# Altium schematic sheet PCIe.SchDoc
size 297 x 209 mm
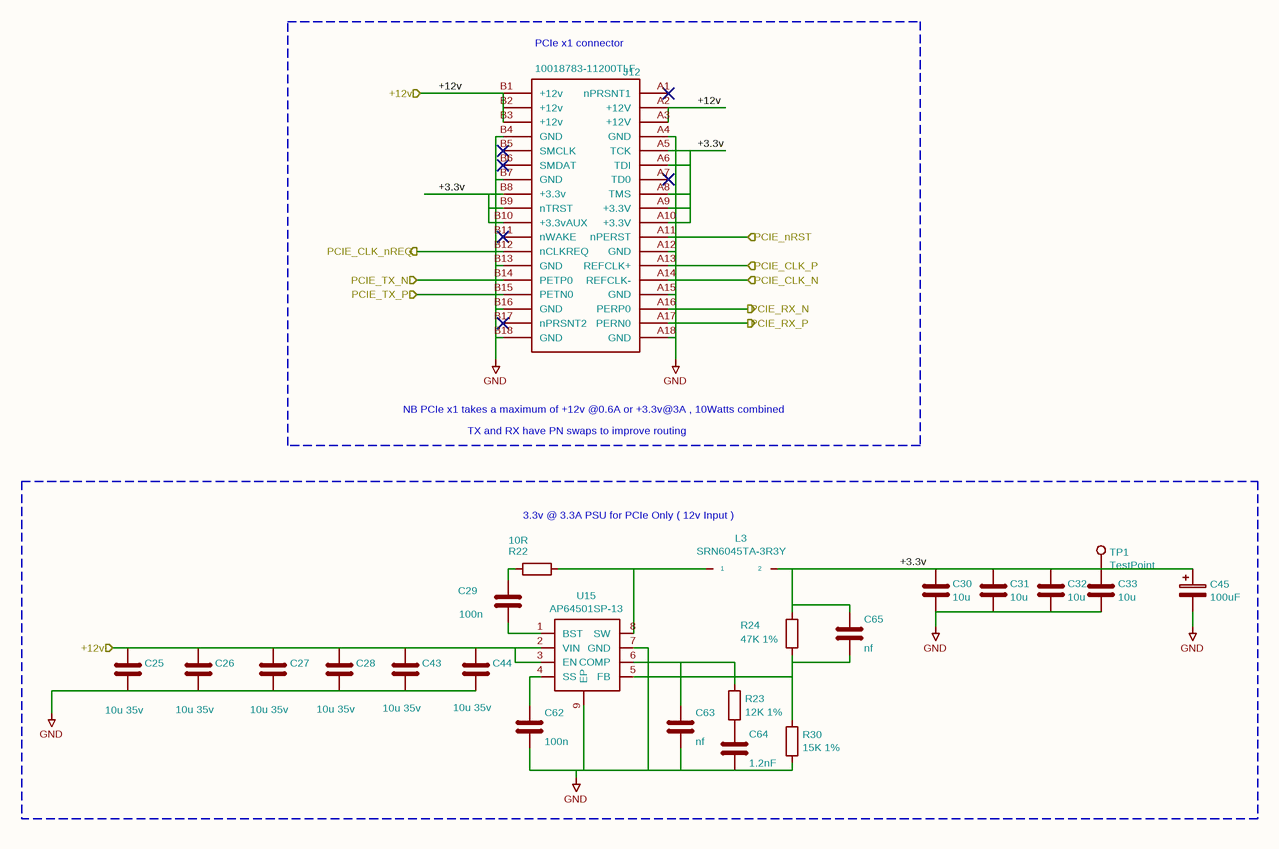
[diagram p0: PCIe.SchDoc]

## Parts
C25  10u 35v  [C_0805_2012Metric]
C26  10u 35v  [C_0805_2012Metric]
C27  10u 35v  [C_0805_2012Metric]
C28  10u 35v  [C_0805_2012Metric]
C29  100n  [C_0402_1005Metric]
C30  10u  [C_0805_2012Metric]
C31  10u  [C_0805_2012Metric]
C32  10u  [C_0805_2012Metric]
C33  10u  [C_0805_2012Metric]
C43  10u 35v  [C_0805_2012Metric]
C44  10u 35v  [C_0805_2012Metric]
C45  100uF  [CP_EIA-7343-31_Kemet-D]
C62  100n  [C_0402_1005Metric]
C63  nf  [C_0402_1005Metric]
C64  1.2nF  [C_0402_1005Metric]
C65  nf  [C_0402_1005Metric]
J12  10018783-11200TLF  [PCIex1-36]
L3  SRN6045TA-3R3Y  [L_Bourns_SRN6045TA]
R22  10R  [R_0402_1005Metric]
R23  12K 1%  [R_0402_1005Metric]
R24  47K 1%  [R_0402_1005Metric]
R30  15K 1%  [R_0402_1005Metric]
TP1  TestPoint  [TestPoint_Pad_2.0x2.0mm]
U15  AP64501SP-13  [SOIC-8-1EP_3.9x4.9mm_P1.27mm_EP2.95x4.9mm_Mask2.71x3.4mm_ThermalVias]

## Blocks framed on the sheet
3.3v @ 3.3A PSU for PCIe Only ( 12v Input ) /: C25-C33 C43-C45 C62-C65 L3 R22-R24 R30 TP1 U15

## Ports
+12v (in), PCIE_CLK_N (in), PCIE_CLK_nREQ (out), PCIE_CLK_P (in), PCIE_nRST (in), PCIE_RX_N (out), PCIE_RX_P (out), PCIE_TX_N (in), PCIE_TX_P (in)

## Nets
GND: C25.2 C26.2 C27.2 C28.2 C30.2 C31.2 C32.2 C33.2 C43.2 C44.2 C45.2 C62.2 C63.2 C64.2 J12.A4(GND) J12.A12(GND) J12.A15(GND) J12.A18(GND) J12.B4(GND) J12.B7(GND) J12.B13(GND) J12.B16(GND) J12.B18(GND) R30.2 U15.7(GND) U15.9(EP)
+3.3v: C30.1 C31.1 C32.1 C33.1 C45.1 C65.1 J12.A5(TCK) J12.A6(TDI) J12.A8(TMS) J12.A9(+3.3V) J12.A10(+3.3V) J12.B8(+3.3v) J12.B9(nTRST) J12.B10(+3.3vAUX) L3.2 R24.1 TP1.1
+12v: C25.1 C26.1 C27.1 C28.1 C43.1 C44.1 J12.A2(+12V) J12.A3(+12V) J12.B1(+12v) J12.B2(+12v) J12.B3(+12v) U15.2(VIN) U15.3(EN) ; port +12v
PCIE_CLK_N: J12.A14(REFCLK-) ; port PCIE_CLK_N
PCIE_CLK_nREQ: J12.B12(nCLKREQ) ; port PCIE_CLK_nREQ
PCIE_CLK_P: J12.A13(REFCLK+) ; port PCIE_CLK_P
PCIE_nRST: J12.A11(nPERST) ; port PCIE_nRST
PCIE_RX_N: J12.A16(PERP0) ; port PCIE_RX_N
PCIE_RX_P: J12.A17(PERN0) ; port PCIE_RX_P
PCIE_TX_N: J12.B14(PETP0) ; port PCIE_TX_N
PCIE_TX_P: J12.B15(PETN0) ; port PCIE_TX_P
NetC29_1: C29.1 R22.2
NetC29_2: C29.2 U15.1(BST)
NetC62_1: C62.1 U15.4(SS)
NetC63_1: C63.1 R23.1 U15.6(COMP)
NetC64_1: C64.1 R23.2
NetC65_2: C65.2 R24.2 R30.1 U15.5(FB)
NetL3_1: L3.1 R22.1 U15.8(SW)

Not connected (* = marked no-connect by the designer): J12 A1(nPRSNT1)* A7(TD0)* B5(SMCLK)* B6(SMDAT)* B11(nWAKE)* B17(nPRSNT2)*

## Notes on the sheet
- (near J12) PCIe x1 connector
- NB PCIe x1 takes a maximum of +12v @0.6A or +3.3v@3A , 10Watts combined
- TX and RX have PN swaps to improve routing
- 1
- 2
- 3
- 4
- 5
- 6
- A
- B
- C
- www.raspberrypi.com <http://www.raspberrypi.com>
- D
- Title: Compute Module 4 IO Board - PCIe
- File: PCIe.kicad_sch
- Sheet: /
- © 2020-2022 Raspberry Pi Ltd (formerly Raspberry Pi (Trading) Ltd.)
- KiCad E.D.A.  kicad (5.1.4)-1
- Size: A4
- Date:
- Rev: 1
- Id: 1/1

## Library data of the parts
C25-C28 C43 C44 = C: Part Description: 10uF 10% or 20% 35V Ceramic Capacitor X6S 0805 (2012 Metric); Field5: 490-10505-1-ND; Field4: Digikey; Field6: GRM21BC8YA106KE11L; Field7: Murata; Value: 10u 35v; Footprint: Capacitor_SMD:C_0805_2012Metric
C29 C62 = C: Part Description: 0.1uF 10% 16V Ceramic Capacitor X7R 0402 (1005 Metric); Field4: Farnell; Field5: 2611911; Field6: RM EMK105 B7104KV-F; Field7: TAIYO YUDEN EUROPE GMBH; Field8: 110091611; Value: 100n; Footprint: Capacitor_SMD:C_0402_1005Metric
C30-C33 = C: Part Description: 10uF 10% 10V Ceramic Capacitor X7R 0805 (2012 Metric); Field5: 490-14381-1-ND; Field4: Digikey; Field6: GRM21BR71A106KA73L; Field7: Murata; Field8: 111893011; Value: 10u; Footprint: Capacitor_SMD:C_0805_2012Metric
C45 = CP: Part Description: Capacitor, SP-Cap, 100u, 6.3V, 15mR ESR; Field4: Mouser; Field5: 667-EEF-CX0J101R; Value: 100uF; Footprint: Capacitor_Tantalum_SMD:CP_EIA-7343-31_Kemet-D
C63 = C: Value: nf; Footprint: Capacitor_SMD:C_0402_1005Metric
C64 = C: Part Description: 1200pF 10% 10V Ceramic Capacitor X5R 0402 (1005 Metric); Field4: Digikey; Field5: 490-16429-1-ND; Field6: GCM155R71H122KA37D; Field7: Murata; Value: 1.2nF; Footprint: Capacitor_SMD:C_0402_1005Metric
C65 = C: Part Description: 27pF 5% 50V Ceramic Capacitor C0G, NP0 0402 (1005 Metric); Field4: Digikey; Field5: 490-17672-2-ND; Field6: GJM1555C1H270JB01D; Field7: Murata; Value: nf; Footprint: Capacitor_SMD:C_0402_1005Metric
J12 = PCIe-x1: Part Description: PCI Express/PCI Connectors PCIE THROUGH HOLE 36P; Field4: Mouser; Field5: 649-10018783-1200TLF; Field7: Amphenol FCI; Field6: 10018783-11200TLF; Value: 10018783-11200TLF; Footprint: CM4IO:PCIex1-36
L3 = INDUCTOR: Part Description: 3.3µH Semi-Shielded Wirewound Inductor 7.8A 21mOhm Nonstandard; Field4: Farnell; Field5: 2616889; Field7: Bourns; Field6: SRN6045TA-3R3Y; Value: SRN6045TA-3R3Y; Footprint: Inductor_SMD:L_Bourns_SRN6045TA
R22 = R: Part Description: Resistor 10R M1005 1% 63mW; Field4: Farnell; Field5: 9238999; Field7: Yageo; Field6: RC0402FR-0710RL; Field8: URES00256; Value: 10R; Footprint: Resistor_SMD:R_0402_1005Metric
R23 = R: Part Description: Resistor 12K M1005 1% 63mW; Field4: Farnell; Field5: 9239367; Field7: Rohm; Field6: MCR01MZPF1202; Value: 12K 1%; Footprint: Resistor_SMD:R_0402_1005Metric
R24 = R: Part Description: Resistor 47K M1005 1% 63mW; Field4: Farnell; Field5: 9239430; Field7: KOA EUROPE GMBH; Field6: RK73G1ETQTP4702D; Field8: 120892781; Value: 47K 1%; Footprint: Resistor_SMD:R_0402_1005Metric
R30 = R: Part Description: Resistor 15K M1005 1% 63mW; Field4: Farnell; Field5: 9239375; Field6: MCR01MZPF1502; Field7: Rohm; Field8: 120891581; Value: 15K 1%; Footprint: Resistor_SMD:R_0402_1005Metric
TP1 = TestPoint: Field4: nf; Field5: nf; Field6: nf; Field7: nf; Value: TestPoint; Footprint: TestPoint:TestPoint_Pad_2.0x2.0mm
U15 = AP64351: Part Description: Buck Switching Regulator IC Positive Adjustable 0.8V 1 Output 5A 8-SOIC (0.154", 3.90mm Width) Exposed Pad; Field4: Digikey; Field5: 31-AP64501SP-13CT-ND; Field7: Diodes; Field6: AP64501SP-13; Value: AP64501SP-13; Footprint: CM4IO:SOIC-8-1EP_3.9x4.9mm_P1.27mm_EP2.95x4.9mm_Mask2.71x3.4mm_ThermalVias